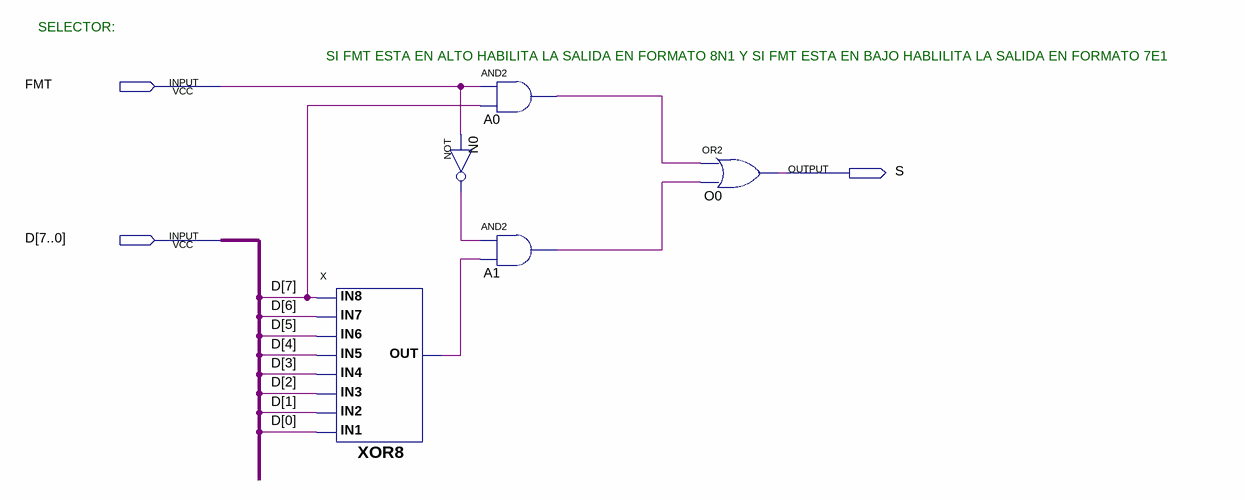
[diagram p0: schematic sheet]
// Quartus schematic Selector8n17e1.bdf as structural Verilog: 5 symbols, 3 pins
module Selector8n17e1 (
  input  FMT,
  input  [7:0] D,
  output S
);

  wire A0_out, A1_out, N0_out, X_out;

  XOR8 X (.IN8(D[7]), .IN1(D[0]), .IN7(D[6]), .IN6(D[5]), .IN5(D[4]), .IN4(D[3]), .IN3(D[2]), .IN2(D[1]), .OUT(X_out));
  and A0 (A0_out, FMT, D[7]);
  not N0 (N0_out, FMT);
  and A1 (A1_out, N0_out, X_out);
  or O0 (S, A0_out, A1_out);

  // Notes on the sheet:
  //   SELECTOR:
  //   SI FMT ESTA EN ALTO HABILITA LA SALIDA EN FORMATO 8N1 Y SI FMT ESTA EN BAJO HABLILITA LA SALIDA EN FORMATO 7E1
endmodule
